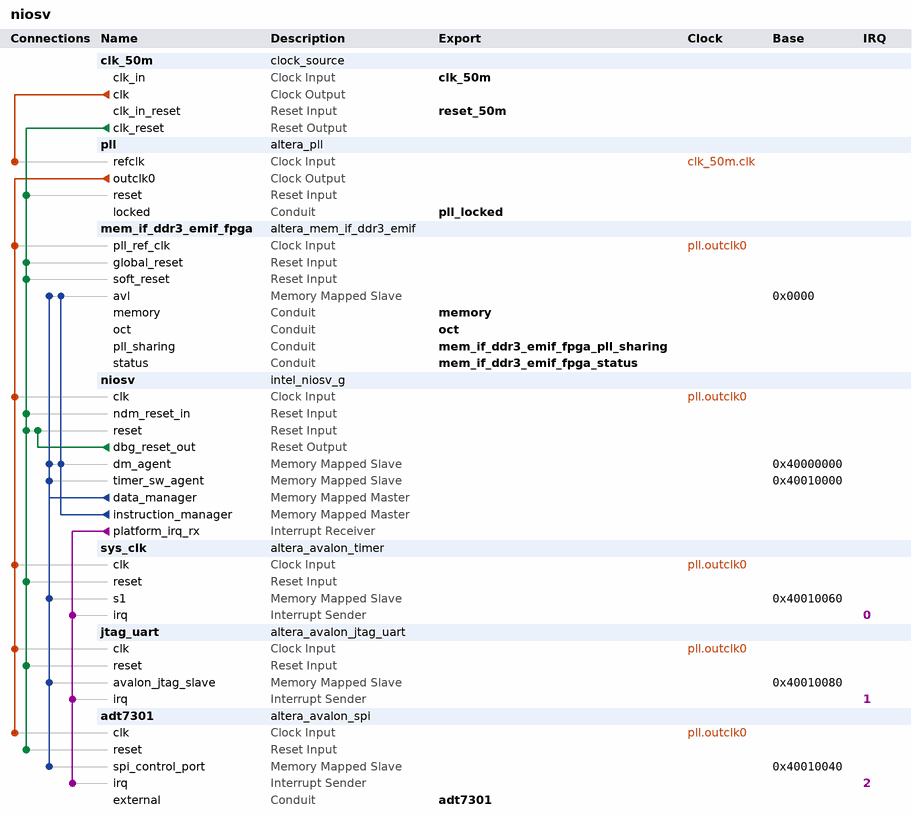
[diagram p0: system contents]
# Platform Designer (Qsys) system niosv, Cyclone V 5CSXFC6D6F31C8ES
# Parameters at their usual value, and those the tool derives, are not listed.
package require -exact qsys 23.1
create_system niosv
set_project_property DEVICE_FAMILY {Cyclone V}
set_project_property DEVICE 5CSXFC6D6F31C8ES

add_instance clk_50m clock_source 23.1
set_instance_parameter_value clk_50m clockFrequency 50000000

add_instance pll altera_pll 23.1
set_instance_parameter_value pll gui_device_speed_grade 1
set_instance_parameter_value pll gui_number_of_clocks 2
set_instance_parameter_value pll gui_operation_mode direct
set_instance_parameter_value pll gui_output_clock_frequency0 50.0
set_instance_parameter_value pll gui_output_clock_frequency1 1.0
set_instance_parameter_value pll gui_pll_mode {Integer-N PLL}
set_instance_parameter_value pll gui_reference_clock_frequency 50.0
set_instance_parameter_value pll gui_use_locked true

add_instance mem_if_ddr3_emif_fpga altera_mem_if_ddr3_emif 23.1
set_instance_parameter_value mem_if_ddr3_emif_fpga AVL_MAX_SIZE 4
set_instance_parameter_value mem_if_ddr3_emif_fpga CALIBRATION_MODE Full
set_instance_parameter_value mem_if_ddr3_emif_fpga CPORT_TYPE_PORT Bidirectional,Bidirectional,Bidirectional,Bidirectional,Bidirectional,Bidirectional
set_instance_parameter_value mem_if_ddr3_emif_fpga EXPORT_AFI_HALF_CLK false
set_instance_parameter_value mem_if_ddr3_emif_fpga HARD_EMIF false
set_instance_parameter_value mem_if_ddr3_emif_fpga MEM_BANKADDR_WIDTH 3
set_instance_parameter_value mem_if_ddr3_emif_fpga MEM_CLK_FREQ 300.0
set_instance_parameter_value mem_if_ddr3_emif_fpga MEM_CLK_FREQ_MAX 400.0
set_instance_parameter_value mem_if_ddr3_emif_fpga MEM_COL_ADDR_WIDTH 10
set_instance_parameter_value mem_if_ddr3_emif_fpga MEM_DQ_WIDTH 32
set_instance_parameter_value mem_if_ddr3_emif_fpga MEM_FORMAT DISCRETE
set_instance_parameter_value mem_if_ddr3_emif_fpga MEM_ROW_ADDR_WIDTH 15
set_instance_parameter_value mem_if_ddr3_emif_fpga MEM_TCL 6
set_instance_parameter_value mem_if_ddr3_emif_fpga MEM_TFAW_NS 50.0
set_instance_parameter_value mem_if_ddr3_emif_fpga MEM_TRAS_NS 37.5
set_instance_parameter_value mem_if_ddr3_emif_fpga MEM_TRCD_NS 15.0
set_instance_parameter_value mem_if_ddr3_emif_fpga MEM_TRFC_NS 300.0
set_instance_parameter_value mem_if_ddr3_emif_fpga MEM_TRP_NS 15.0
set_instance_parameter_value mem_if_ddr3_emif_fpga MEM_TRRD_NS 13.2
set_instance_parameter_value mem_if_ddr3_emif_fpga MEM_TRTP_NS 13.2
set_instance_parameter_value mem_if_ddr3_emif_fpga MEM_TWTR 4
set_instance_parameter_value mem_if_ddr3_emif_fpga MEM_VENDOR JEDEC
set_instance_parameter_value mem_if_ddr3_emif_fpga MEM_WTCL 5
set_instance_parameter_value mem_if_ddr3_emif_fpga PLL_LOCATION Top_Bottom
set_instance_parameter_value mem_if_ddr3_emif_fpga POWER_OF_TWO_BUS false
set_instance_parameter_value mem_if_ddr3_emif_fpga PRIORITY_PORT 1,1,1,1,1,1
set_instance_parameter_value mem_if_ddr3_emif_fpga RATE Half
set_instance_parameter_value mem_if_ddr3_emif_fpga REF_CLK_FREQ 50.0
set_instance_parameter_value mem_if_ddr3_emif_fpga SPEED_GRADE 8
set_instance_parameter_value mem_if_ddr3_emif_fpga TIMING_BOARD_AC_SKEW 0.02
set_instance_parameter_value mem_if_ddr3_emif_fpga TIMING_BOARD_AC_TO_CK_SKEW 0.0
set_instance_parameter_value mem_if_ddr3_emif_fpga TIMING_BOARD_DQ_TO_DQS_SKEW 0.0
set_instance_parameter_value mem_if_ddr3_emif_fpga TIMING_BOARD_MAX_CK_DELAY 0.6
set_instance_parameter_value mem_if_ddr3_emif_fpga TIMING_BOARD_MAX_DQS_DELAY 0.6
set_instance_parameter_value mem_if_ddr3_emif_fpga TIMING_BOARD_SKEW_BETWEEN_DQS 0.02
set_instance_parameter_value mem_if_ddr3_emif_fpga TIMING_BOARD_SKEW_CKDQS_DIMM_MAX 0.01
set_instance_parameter_value mem_if_ddr3_emif_fpga TIMING_BOARD_SKEW_CKDQS_DIMM_MIN -0.01
set_instance_parameter_value mem_if_ddr3_emif_fpga TIMING_BOARD_SKEW_WITHIN_DQS 0.02
set_instance_parameter_value mem_if_ddr3_emif_fpga TIMING_TDH 150
set_instance_parameter_value mem_if_ddr3_emif_fpga TIMING_TDQSCK 400
set_instance_parameter_value mem_if_ddr3_emif_fpga TIMING_TDQSQ 200
set_instance_parameter_value mem_if_ddr3_emif_fpga TIMING_TDQSS 0.25
set_instance_parameter_value mem_if_ddr3_emif_fpga TIMING_TDS 75
set_instance_parameter_value mem_if_ddr3_emif_fpga TIMING_TDSH 0.2
set_instance_parameter_value mem_if_ddr3_emif_fpga TIMING_TDSS 0.2
set_instance_parameter_value mem_if_ddr3_emif_fpga TIMING_TIH 275
set_instance_parameter_value mem_if_ddr3_emif_fpga TIMING_TIS 200
set_instance_parameter_value mem_if_ddr3_emif_fpga TIMING_TQSH 0.38
set_instance_parameter_value mem_if_ddr3_emif_fpga USER_DEBUG_LEVEL 0

add_instance niosv intel_niosv_g 1.0.0
set_instance_parameter_value niosv clockFrequency 50000000
set_instance_parameter_value niosv dataCacheSize 4096
set_instance_parameter_value niosv dtcm1Base 0
set_instance_parameter_value niosv dtcm1Size 0
set_instance_parameter_value niosv dtcm2Base 0
set_instance_parameter_value niosv dtcm2Size 0
set_instance_parameter_value niosv enableDebug true
set_instance_parameter_value niosv enableDebugReset true
set_instance_parameter_value niosv enableECCLite false
set_instance_parameter_value niosv enableFPU false
set_instance_parameter_value niosv enableMulDiv true
set_instance_parameter_value niosv instCacheSize 4096
set_instance_parameter_value niosv itcm1Base 0
set_instance_parameter_value niosv itcm1Size 0
set_instance_parameter_value niosv itcm2Base 0
set_instance_parameter_value niosv itcm2Size 0
set_instance_parameter_value niosv peripheralRegionABase 0
set_instance_parameter_value niosv peripheralRegionASize 65536
set_instance_parameter_value niosv peripheralRegionBBase 0
set_instance_parameter_value niosv peripheralRegionBSize 0
set_instance_parameter_value niosv resetOffset 0
set_instance_parameter_value niosv resetSlave mem_if_ddr3_emif_fpga.avl
set_instance_parameter_value niosv useResetReq false

add_instance sys_clk altera_avalon_timer 23.1
set_instance_parameter_value sys_clk period 1
set_instance_parameter_value sys_clk periodUnits MSEC

add_instance jtag_uart altera_avalon_jtag_uart 23.1
set_instance_parameter_value jtag_uart simInteractiveOptions NO_INTERACTIVE_WINDOWS

add_instance adt7301 altera_avalon_spi 23.1
set_instance_parameter_value adt7301 clockPolarity 0
set_instance_parameter_value adt7301 dataWidth 8
set_instance_parameter_value adt7301 masterSPI true
set_instance_parameter_value adt7301 numberOfSlaves 1
set_instance_parameter_value adt7301 targetClockRate 200000

# connections
add_connection clk_50m.clk pll.refclk clock
add_connection pll.outclk0 adt7301.clk clock
add_connection pll.outclk0 jtag_uart.clk clock
add_connection pll.outclk0 mem_if_ddr3_emif_fpga.pll_ref_clk clock
add_connection pll.outclk0 niosv.clk clock
add_connection pll.outclk0 sys_clk.clk clock
add_connection clk_50m.clk_reset adt7301.reset reset
add_connection clk_50m.clk_reset jtag_uart.reset reset
add_connection clk_50m.clk_reset mem_if_ddr3_emif_fpga.global_reset reset
add_connection clk_50m.clk_reset mem_if_ddr3_emif_fpga.soft_reset reset
add_connection clk_50m.clk_reset niosv.ndm_reset_in reset
add_connection clk_50m.clk_reset niosv.reset reset
add_connection clk_50m.clk_reset pll.reset reset
add_connection clk_50m.clk_reset sys_clk.reset reset
add_connection niosv.dbg_reset_out niosv.reset reset
add_connection niosv.data_manager adt7301.spi_control_port avalon
set_connection_parameter_value niosv.data_manager/adt7301.spi_control_port baseAddress 0x40010040
add_connection niosv.data_manager jtag_uart.avalon_jtag_slave avalon
set_connection_parameter_value niosv.data_manager/jtag_uart.avalon_jtag_slave baseAddress 0x40010080
add_connection niosv.data_manager mem_if_ddr3_emif_fpga.avl avalon
set_connection_parameter_value niosv.data_manager/mem_if_ddr3_emif_fpga.avl baseAddress 0x0000
add_connection niosv.data_manager niosv.dm_agent avalon
set_connection_parameter_value niosv.data_manager/niosv.dm_agent baseAddress 0x40000000
add_connection niosv.data_manager niosv.timer_sw_agent avalon
set_connection_parameter_value niosv.data_manager/niosv.timer_sw_agent baseAddress 0x40010000
add_connection niosv.data_manager sys_clk.s1 avalon
set_connection_parameter_value niosv.data_manager/sys_clk.s1 baseAddress 0x40010060
add_connection niosv.instruction_manager mem_if_ddr3_emif_fpga.avl avalon
set_connection_parameter_value niosv.instruction_manager/mem_if_ddr3_emif_fpga.avl baseAddress 0x0000
add_connection niosv.instruction_manager niosv.dm_agent avalon
set_connection_parameter_value niosv.instruction_manager/niosv.dm_agent baseAddress 0x40000000
add_connection niosv.platform_irq_rx adt7301.irq interrupt
set_connection_parameter_value niosv.platform_irq_rx/adt7301.irq irqNumber 2
add_connection niosv.platform_irq_rx jtag_uart.irq interrupt
set_connection_parameter_value niosv.platform_irq_rx/jtag_uart.irq irqNumber 1
add_connection niosv.platform_irq_rx sys_clk.irq interrupt
set_connection_parameter_value niosv.platform_irq_rx/sys_clk.irq irqNumber 0

# exported interfaces
add_interface adt7301 conduit end
set_interface_property adt7301 EXPORT_OF adt7301.external
add_interface clk_50m clock sink
set_interface_property clk_50m EXPORT_OF clk_50m.clk_in
add_interface mem_if_ddr3_emif_fpga_pll_sharing conduit end
set_interface_property mem_if_ddr3_emif_fpga_pll_sharing EXPORT_OF mem_if_ddr3_emif_fpga.pll_sharing
add_interface mem_if_ddr3_emif_fpga_status conduit end
set_interface_property mem_if_ddr3_emif_fpga_status EXPORT_OF mem_if_ddr3_emif_fpga.status
add_interface memory conduit end
set_interface_property memory EXPORT_OF mem_if_ddr3_emif_fpga.memory
add_interface oct conduit end
set_interface_property oct EXPORT_OF mem_if_ddr3_emif_fpga.oct
add_interface pll_locked conduit end
set_interface_property pll_locked EXPORT_OF pll.locked
add_interface reset_50m reset sink
set_interface_property reset_50m EXPORT_OF clk_50m.clk_in_reset

set_interconnect_requirement {$system} qsys_mm.clockCrossingAdapter HANDSHAKE
set_interconnect_requirement {$system} qsys_mm.enableEccProtection FALSE
set_interconnect_requirement {$system} qsys_mm.insertDefaultSlave FALSE
set_interconnect_requirement {$system} qsys_mm.maxAdditionalLatency 1

save_system niosv.qsys
